# Altium schematic sheet SW-RPi-Zero-A.SchDoc: Sch Templates
size A4; DocumentNumber: 1; SheetNumber: 1; SheetTotal: 1
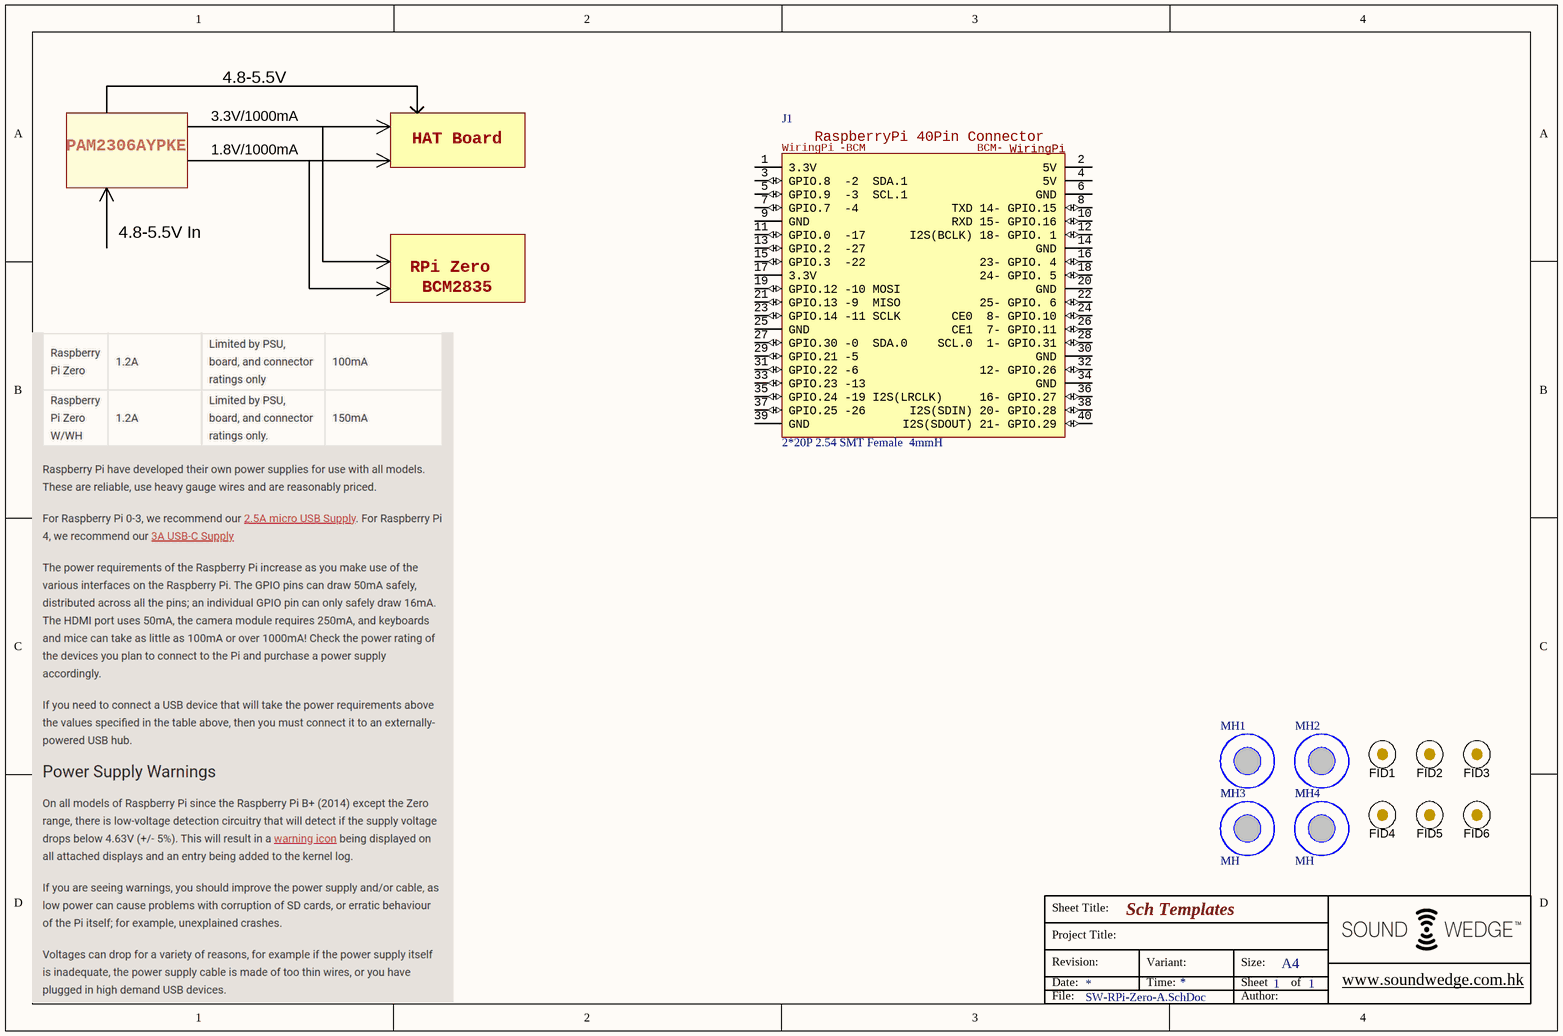
[diagram p0: SW-RPi-Zero-A.SchDoc]

## Parts
FID1  Fiducial  [FID10-20]  (value not drawn)
FID2  Fiducial  [FID10-20]  (value not drawn)
FID3  Fiducial  [FID10-20]  (value not drawn)
FID4  Fiducial  [FID10-20]  (value not drawn)
FID5  Fiducial  [FID10-20]  (value not drawn)
FID6  Fiducial  [FID10-20]  (value not drawn)
J1  2*20P 2.54 SMT Female  4mmH  [SMT2X20/2.54x3.5-Bottom]
MH1  MH  [M2.5]
MH2  MH  [M2.5]
MH3  MH  [M2.5]
MH4  MH  [M2.5]

## Nets

Not connected (* = marked no-connect by the designer): J1 1(3.3V) 2(5V) 3(GPIO.8__-2__SDA.1) 4(5V) 5(GPIO.9__-3__SCL.1) 6(GND) 7(GPIO.7__-4) 8(TXD_14-_GPIO.15) 9(GND) 10(RXD_15-_GPIO.16) 11(GPIO.0__-17) 12(I2S(BCLK)_18-_GPIO._1) 13(GPIO.2__-27) 14(GND) 15(GPIO.3__-22) 16(23-_GPIO._4) 17(3.3V) 18(24-_GPIO._5) 19(GPIO.12_-10_MOSI) 20(GND) 21(GPIO.13_-9__MISO) 22(25-_GPIO._6) 23(GPIO.14_-11_SCLK) 24(CE0__8-_GPIO.10) 25(GND) 26(CE1__7-_GPIO.11) 27(GPIO.30_-0__SDA.0) 28(SCL.0__1-_GPIO.31) 29(GPIO.21_-5) 30(GND) 31(GPIO.22_-6) 32(12-_GPIO.26) 33(GPIO.23_-13) 34(GND) 35(GPIO.24_-19_I2S(LRCLK)) 36(16-_GPIO.27) 37(GPIO.25_-26) 38(I2S(SDIN)_20-_GPIO.28) 39(GND) 40(I2S(SDOUT)_21-_GPIO.29)

## Notes on the sheet
- 3.3V/1000mA
- 4.8-5.5V
- PAM2306AYPKE
- 1.8V/1000mA
- HAT Board
- 4.8-5.5V In
- RPi Zero
- BCM2835
- Sheet Title:
- Project Title:
- Date:
- Revision:
- Time:
- Variant:
- Size:
- Sheet
- A4
- of
- www.soundwedge.com.hk <http://www.soundwedge.com.hk>
- File:
- Author:
- (in symbol RPi-Connector-40P) RaspberryPi 40Pin Connector; WiringPi; -BCM; BCM-

## Library data of the parts
FID1-FID6 = Fiducial: Fiducial mark.  There is nothing to buy or mount.; SymbolCreator: codlsc; SymbolVersion: 2009-11-4; CompType: Fiducial; PackageReference: N/A; ClassName: FiducialMark; Manufacturer: N/A; PartNumber: N/A; MountType: N/A; Publisher: Texas Instruments; LatestRevisionDate: 2014-10-27; LatestRevisionNote: Added Alternate PartNumber and Alternate Manufacturer parameters to appropriate components.
J1 = RPi-Connector-40P
MH1-MH4 = MH: 安装孔-附加安装铜柱信息